# EAGLE schematic brushbot2.0 (EAGLE 9.4.2)
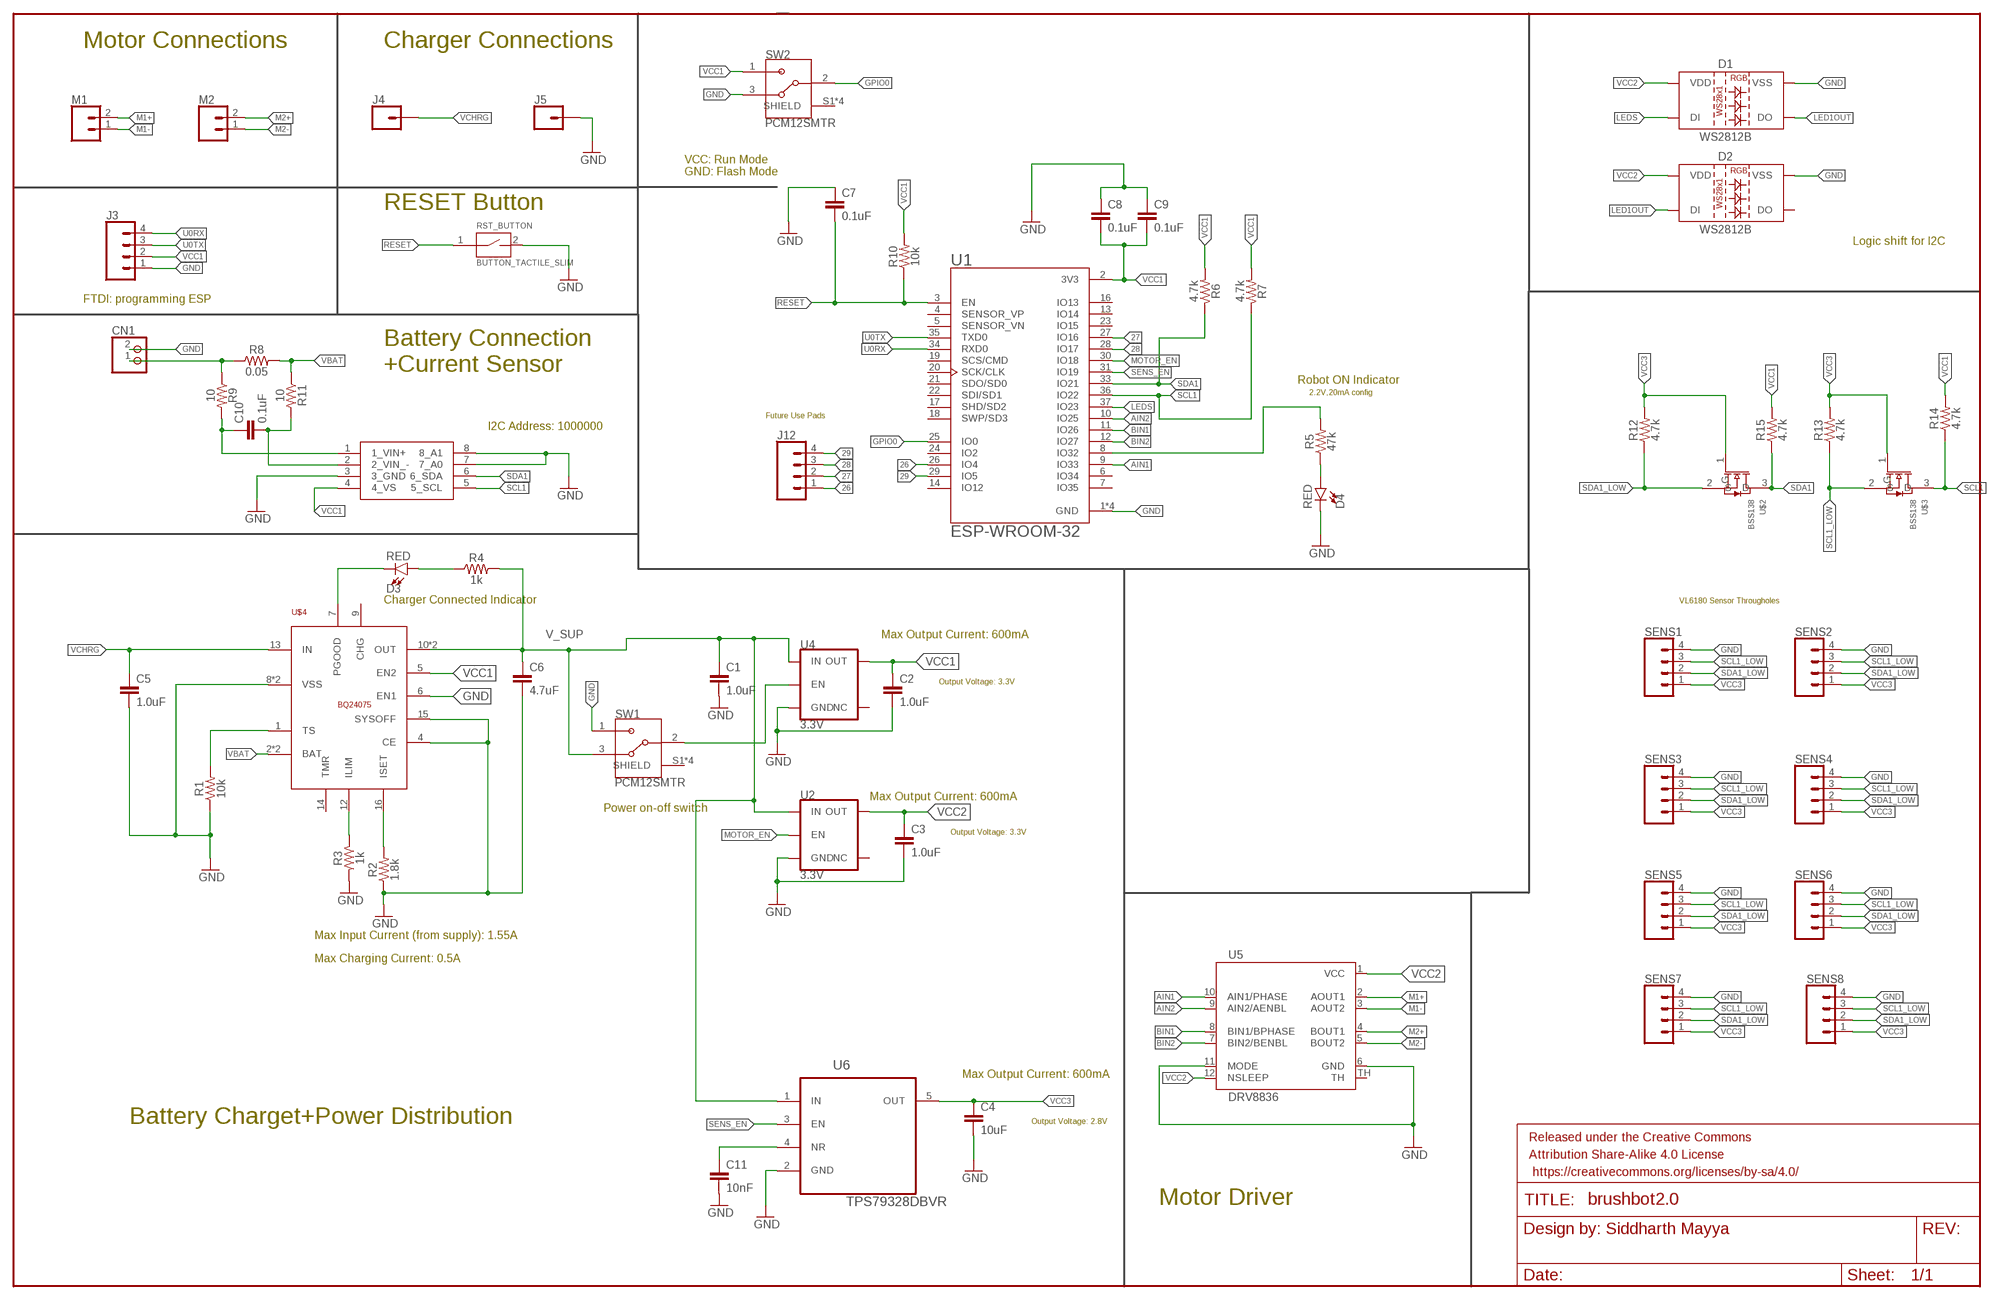
[diagram p0: schematic, sheet 1]

## Parts
C1  1.0uF  1.0UF-0603-16V-10%  [0603]
C2  1.0uF  1.0UF-0603-16V-10%  [0603]
C3  1.0uF  1.0UF-0603-16V-10%  [0603]
C4  10uF  10UF-0603-6.3V-20%  [0603]
C5  1.0uF  1.0UF-0603-16V-10%  [0603]
C6  4.7uF  4.7UF-0603-6.3V-(10%)  [0603]
C7  0.1uF  0.1UF-0603-25V-(+80/-20%)  [0603]
C8  0.1uF  0.1UF-0603-25V-(+80/-20%)  [0603]
C9  0.1uF  0.1UF-0603-25V-(+80/-20%)  [0603]
C10  0.1uF  0.1UF-0603-25V-(+80/-20%)  [0603]
C11  10nF  10NF-0603-50V-10%  [0603]
CN1  JST_2PIN-SMT-RA  [JST-PH-2-SMT-RA]
D1  WS2812B  [WS2812B]
D2  WS2812B  [WS2812B]
D3  RED  LED-RED0603  [LED-0603]
D4  RED  LED-RED0603  [LED-0603]
FRAME2  FRAME-LEDGER  [CREATIVE_COMMONS]
J3  CONN_04PTH  [1X04]
J4  CONN_01  [1X01]
J5  CONN_01  [1X01]
J12  CONN_04PTH  [1X04]
M1  CONN_02  [1X02]
M2  CONN_02  [1X02]
R1  10k  10KOHM-0603-1/10W-1%  [0603]
R2  1.8k  1.8KOHM-0603-1/10W-1%  [0603]
R3  1k  1KOHM-0603-1/10W-1%  [0603]
R4  1k  1KOHM-0603-1/10W-1%  [0603]
R5  47k  47KOHM-0603-1/10W-1%  [0603]
R6  4.7k  4.7KOHM-0603-1/10W-1%  [0603]
R7  4.7k  4.7KOHM-0603-1/10W-1%  [0603]
R8  0.05  0.05OHM-0603-1/5W-1%  [0603]
R9  10  10OHM-0603-1/10W-1%  [0603]
R10  10k  10KOHM-0603-1/10W-1%  [0603]
R11  10  10OHM-0603-1/10W-1%  [0603]
R12  4.7k  4.7KOHM-0603-1/10W-1%  [0603]
R13  4.7k  4.7KOHM-0603-1/10W-1%  [0603]
R14  4.7k  4.7KOHM-0603-1/10W-1%  [0603]
R15  4.7k  4.7KOHM-0603-1/10W-1%  [0603]
RST_BUTTON  BUTTON_TACTILE_SLIM  [BUTTON_TACTILE_SLIM]
SENS1  CONN_04PTH  [1X04]
SENS2  CONN_04PTH  [1X04]
SENS3  CONN_04PTH  [1X04]
SENS4  CONN_04PTH  [1X04]
SENS5  CONN_04PTH  [1X04]
SENS6  CONN_04PTH  [1X04]
SENS7  CONN_04PTH  [1X04]
SENS8  CONN_04PTH  [1X04]
SW1  PCM12SMTR  [SW_PCM12SMTR]
SW2  PCM12SMTR  [SW_PCM12SMTR]
U1  ESP-WROOM-32  [MODULE_ESP-WROOM-32]
U2  3.3V  V_REG_AP2112K-3.3V  [SOT23-5]
U4  3.3V  V_REG_AP2112K-3.3V  [SOT23-5]
U5  DRV8836  [12WSON]
U6  TPS79328DBVR  [SOT95P280X145-5N]
U$1  INA219  [SOT-23-8]
U$2  BSS138  [SOT23-3]
U$3  BSS138  [SOT23-3]
U$4  BQ24075  [QFN16]

## Nets
26: J12.1 U1.26(IO4)
27: J12.2 U1.27(IO16)
28: J12.3 U1.28(IO17)
29: J12.4 U1.29(IO5)
AIN1: U1.9(IO33) U5.10(AIN1/PHASE)
AIN2: U1.10(IO25) U5.9(AIN2/AENBL)
BIN1: U1.11(IO26) U5.8(BIN1/BPHASE)
BIN2: U1.12(IO27) U5.7(BIN2/BENBL)
GND: C1.2 C2.2 C3.2 C4.2 C5.2 C6.2 C7.1 C8.1 C9.1 C11.2 CN1.2 D1.3(VSS) D2.3(VSS) D4.C J3.1 J5.1 R1.1 R2.1 R3.2 RST_BUTTON.2 SENS1.4 SENS2.4 SENS3.4 SENS4.4 SENS5.4 SENS6.4 SENS7.4 SENS8.4 SW1.1 SW2.3 U1.1(GND) U1.1.1(GND) U1.15(GND) U1.38(GND) U2.2(GND) U4.2(GND) U5.6(GND) U5.11(MODE) U6.2(GND) U$1.3(3_GND) U$1.7(7_A0) U$1.8(8_A1) U$4.4(CE) U$4.6(EN1) U$4.8(VSS) U$4.15(SYSOFF) U$4.TH(VSS)
GPIO0: SW2.2 U1.25(IO0)
LED1OUT: D1.2(DO) D2.4(DI)
LEDS: D1.4(DI) U1.37(IO23)
M1+: M1.2 U5.2(AOUT1)
M1-: M1.1 U5.3(AOUT2)
M2+: M2.2 U5.4(BOUT1)
M2-: M2.1 U5.5(BOUT2)
MOTOR_EN: U1.30(IO18) U2.3(EN)
N$1: R1.2 U$4.1(TS)
N$2: SW1.2 U4.3(EN)
N$3: R2.2 U$4.16(ISET)
N$4: R3.1 U$4.12(ILIM)
N$5: C10.1 R9.2 U$1.1(1_VIN+)
N$7: D3.C U$4.7(PGOOD)
N$8: D3.A R4.1
N$9: R5.2 U1.8(IO32)
N$10: D4.A R5.1
N$11: C10.2 R11.2 U$1.2(2_VIN_-)
N$12: CN1.1 R8.1 R9.1
N$14: C11.1 U6.4(NR)
RESET: C7.2 R10.1 RST_BUTTON.1 U1.3(EN)
SCL1: R7.1 R14.1 U1.36(IO22) U$1.5(5_SCL) U$3.3(D)
SCL1_LOW: R13.1 SENS1.3 SENS2.3 SENS3.3 SENS4.3 SENS5.3 SENS6.3 SENS7.3 SENS8.3 U$3.2(S)
SDA1: R6.1 R15.1 U1.33(IO21) U$1.6(6_SDA) U$2.3(D)
SDA1_LOW: R12.1 SENS1.2 SENS2.2 SENS3.2 SENS4.2 SENS5.2 SENS6.2 SENS7.2 SENS8.2 U$2.2(S)
SENS_EN: U1.31(IO19) U6.3(EN)
U0RX: J3.4 U1.34(RXD0)
U0TX: J3.3 U1.35(TXD0)
V_SUP: C1.1 C6.1 R4.2 SW1.3 U2.1(IN) U4.1(IN) U6.1(IN) U$4.10(OUT) U$4.11(OUT)
VBAT: R8.2 R11.1 U$4.2(BAT) U$4.3(BAT)
VCC1: C2.1 C8.2 C9.2 J3.2 R6.2 R7.2 R10.2 R14.2 R15.2 SW2.1 U1.2(3V3) U4.5(OUT) U$1.4(4_VS) U$4.5(EN2)
VCC2: C3.1 D1.1(VDD) D2.1(VDD) U2.5(OUT) U5.1(VCC) U5.12(NSLEEP)
VCC3: C4.1 R12.2 R13.2 SENS1.1 SENS2.1 SENS3.1 SENS4.1 SENS5.1 SENS6.1 SENS7.1 SENS8.1 U6.5(OUT) U$2.1(G) U$3.1(G)
VCHRG: C5.1 J4.1 U$4.13(IN)
Unconnected: D2.2(DO) SW1.S1(SHIELD) SW1.S2(SHIELD) SW1.S3(SHIELD) SW1.S4(SHIELD) SW2.S1(SHIELD) SW2.S2(SHIELD) SW2.S3(SHIELD) SW2.S4(SHIELD) U1.4(SENSOR_VP) U1.5(SENSOR_VN) U1.6(IO34) U1.7(IO35) U1.13(IO14) U1.14(IO12) U1.16(IO13) U1.17(SHD/SD2) U1.18(SWP/SD3) U1.19(SCS/CMD) U1.20(SCK/CLK) U1.21(SDO/SD0) U1.22(SDI/SD1) U1.23(IO15) U1.24(IO2) U2.4(NC) U4.4(NC) U5.TH U$4.9(CHG) U$4.14(TMR)

## Notes on the sheet
- Motor Connections | Charger Connections
- VCC: Run Mode
  GND: Flash Mode
- RESET Button
- Logic shift for I2C
- FTDI: programming ESP
- Battery Connection
  +Current Sensor
- Robot ON Indicator
- 2.2V,20mA config
- Future Use Pads
- I2C Address: 1000000
- Charger Connected Indicator | VL6180 Sensor Througholes
- Max Output Current: 600mA
- Output Voltage: 3.3V
- Max Output Current: 600mA
- Power on-off switch
- Output Voltage: 3.3V
- Max Input Current (from supply): 1.55A
- Max Charging Current: 0.5A
- Max Output Current: 600mA
- Battery Charget+Power Distribution | Output Voltage: 2.8V
- Motor Driver

## Library data of the parts
C1-C3 C5 = SparkFun-Capacitors:1.0UF: 1µF ceramic capacitors A capacitor is a passive two-terminal electrical component used to store electrical energy temporarily in an electric field.; PROD_ID: CAP-00868
C4 = SparkFun-Capacitors:10UF: 10.0µF ceramic capacitors A capacitor is a passive two-terminal electrical component used to store electrical energy temporarily in an electric field.; PROD_ID: CAP-11015
C6 = SparkFun-Capacitors:4.7UF: 4.7µF ceramic capacitors A capacitor is a passive two-terminal electrical component used to store electrical energy temporarily in an electric field.; PROD_ID: CAP-08280
C7-C10 = SparkFun-Capacitors:0.1UF: 0.1µF ceramic capacitors A capacitor is a passive two-terminal electrical component used to store electrical energy temporarily in an electric field.; PROD_ID: CAP-00810
C11 = SparkFun-Capacitors:10NF: 0.01uF/10nF/10,000pF ceramic capacitors A capacitor is a passive two-terminal electrical component used to store electrical energy temporarily in an electric field. CAP-09321; PROD_ID: CAP-00867
CN1 = adafruit:JST_2PIN: JST 2-Pin Connectors of various flavors SMT-RA (S2B-PH-SM4) 4UConnector #17311 SMT (B2B-PH-SM4) THM-RA (S2B-PH) THM (B2B-PH)
D1 D2 = SparkFun-LED:WS2812B: WS2812B SMD addressable RGB LED 5x5mm SMD LED with built-in controller IC. Color: Red/Green/Blue mC Rating: RGB: 390, 660, 180 mcd Forward Voltage: RGB: 2.0, 3.0, 3.0 V Packages:WS2812B SparkFun Products: Blynk Board - ESP8266 <https://www.sparkfun.com/products/13794>; PROD_ID: DIO-12503
D3 D4 = SparkFun-LED:LED-RED: Red SMD LED Used in manufacturing of most products at SparkFun Packages: 0603 - SMD 0603 package [Product Link] <http://docs.avagotech.com/docs/AV02-0551EN> 0603 SMART - SMD 0603 SMART package ( more efficient and expensive)[Product Link] <http://www.osram-os.com/Graphics/XPic2/00077099_0.pdf> 1206 - SMD1206 package [Product Link] <https://www.sparkfun.com/datasheets/DevTools/LilyPad/Q150OVS4.pdff> SparkFun Products: Pro Mini 328 -5V <https://www.sparkfun.com/products/821> RedBoard <https://www.sparkfun.com/products/12757> IOIO-OTG <https://www.sparkfun.com/products/13613>; PROD_ID: DIO-00819
FRAME2 = GRITSBot:FRAME-LEDGER: Schematic Frame Standard 11x14 US Ledger frame
J3 J12 SENS1-SENS8 = SparkFun-Connectors:CONN_04: Multi connection point. Often used as Generic Header-pin footprint for 0.1 inch spaced/style header connections On any of the 0.1 inch spaced packages, you can populate with these: Break Away Headers - Straight <https://www.sparkfun.com/products/116> (PRT-00116) Break Away Male Headers - Right Angle <https://www.sparkfun.com/products/553> (PRT-00553) Female Headers <https://www.sparkfun.com/products/115> (PRT-00115) Break Away Headers - Machine Pin <https://www.sparkfun.com/products/117> (PRT-00117) Break Away Female Headers - Swiss Machine Pin <https://www.sparkfun.com/products/743> (PRT-00743) For SCREWTERMINALS and SPRING TERMINALS visit here: Screw Terimnals on SparkFun.com <https://www.sparkfun.com/search/results?term=Screw+Terminals> (5mm/3.5mm/2.54mm spacing) This device is also useful as a general connection point to wire up your design to another part of your project. Our various solder wires solder well into these plated through hole pads. Hook-Up Wire - Assortment (Stranded, 22 AWG) <https://www.sparkfun.com/products/11375> (PRT-11375) Hook-Up Wire - Assortment (Solid Core, 22 AWG) <https://www.sparkfun.com/products/11367> (PRT-11367) View the entire wire category on our website here <https://www.sparkfun.com/categories/141> Special notes: Molex polarized connector foot print use with SKU : PRT-08231 with associated crimp pins and housings. 1MM SMD Version SKU: PRT-10208; PROD_ID: CONN-09696
J4 J5 = SparkFun-Connectors:CONN_01: Single connection point. Often used as Generic Header-pin footprint for 0.1 inch spaced/style header connections On any of the 0.1 inch spaced packages, you can populate with these: Break Away Headers - Straight <https://www.sparkfun.com/products/116> (PRT-00116) Break Away Male Headers - Right Angle <https://www.sparkfun.com/products/553> (PRT-00553) Female Headers <https://www.sparkfun.com/products/115> (PRT-00115) Break Away Headers - Machine Pin <https://www.sparkfun.com/products/117> (PRT-00117) Break Away Female Headers - Swiss Machine Pin <https://www.sparkfun.com/products/743> (PRT-00743) This device is also useful as a general connection point to wire up your design to another part of your project. Our various solder wires solder well into these plated through hole pads. Hook-Up Wire - Assortment (Stranded, 22 AWG) <https://www.sparkfun.com/products/11375> (PRT-11375) Hook-Up Wire - Assortment (Solid Core, 22 AWG) <https://www.sparkfun.com/products/11367> (PRT-11367) View the entire wire category on our website here <https://www.sparkfun.com/categories/141> Special notes: SMTSO-256-ET is a "flush mount" nut for a 4-40 screw. We mostly use this on specialty testbeds; it is a nice way to connect hardware to your PCB at an adjustable hieght. Also note, the SNAP packages are for using a snappable style connector. We sell a baggie of snaps and they are also used on two LilyPad designs: Snap Assortment - 30 pack (male and female) <https://www.sparkfun.com/products/11347> (DEV-11347) LilyPad Arduino SimpleSnap <https://www.sparkfun.com/products/10941> (DEV-10941) LilyPad SimpleSnap Protoboard <https://www.sparkfun.com/products/10940> (DEV-10940)
M1 M2 = SparkFun-Connectors:CONN_02: Multi connection point. Often used as Generic Header-pin footprint for 0.1 inch spaced/style header connections On any of the 0.1 inch spaced packages, you can populate with these: Break Away Headers - Straight <https://www.sparkfun.com/products/116> (PRT-00116) Break Away Male Headers - Right Angle <https://www.sparkfun.com/products/553> (PRT-00553) Female Headers <https://www.sparkfun.com/products/115> (PRT-00115) Break Away Headers - Machine Pin <https://www.sparkfun.com/products/117> (PRT-00117) Break Away Female Headers - Swiss Machine Pin <https://www.sparkfun.com/products/743> (PRT-00743) For SCREWTERMINALS and SPRING TERMINALS visit here: Screw Terimnals on SparkFun.com <https://www.sparkfun.com/search/results?term=Screw+Terminals> (5mm/3.5mm/2.54mm spacing) This device is also useful as a general connection point to wire up your design to another part of your project. Our various solder wires solder well into these plated through hole pads. Hook-Up Wire - Assortment (Stranded, 22 AWG) <https://www.sparkfun.com/products/11375> (PRT-11375) Hook-Up Wire - Assortment (Solid Core, 22 AWG) <https://www.sparkfun.com/products/11367> (PRT-11367) View the entire wire category on our website here <https://www.sparkfun.com/categories/141> Special notes: Molex polarized connector foot print use with: PRT-08233 with associated crimp pins and housings. 2.54_SCREWTERM for use with PRT-10571. 3.5mm Screw Terminal footprints for PRT-08084 5mm Screw Terminal footprints for use with PRT-08432
R1 R10 = SparkFun-Resistors:10KOHM: 10kΩ resistor A resistor is a passive two-terminal electrical component that implements electrical resistance as a circuit element. Resistors act to reduce current flow, and, at the same time, act to lower voltage levels within circuits. - Wikipedia; PROD_ID: RES-00824
R2 = SparkFun-Resistors:1.8KOHM: 1.8kΩ resistor A resistor is a passive two-terminal electrical component that implements electrical resistance as a circuit element. Resistors act to reduce current flow, and, at the same time, act to lower voltage levels within circuits. - Wikipedia; PROD_ID: RES-09119
R3 R4 = SparkFun-Resistors:1KOHM: 1kΩ resistor A resistor is a passive two-terminal electrical component that implements electrical resistance as a circuit element. Resistors act to reduce current flow, and, at the same time, act to lower voltage levels within circuits. - Wikipedia; PROD_ID: RES-07856
R5 = SparkFun-Resistors:47KOHM: 47kΩ resistor A resistor is a passive two-terminal electrical component that implements electrical resistance as a circuit element. Resistors act to reduce current flow, and, at the same time, act to lower voltage levels within circuits. - Wikipedia; PROD_ID: RES-07871
R6 R7 R12-R15 = SparkFun-Resistors:4.7KOHM: 4.7kΩ resistor A resistor is a passive two-terminal electrical component that implements electrical resistance as a circuit element. Resistors act to reduce current flow, and, at the same time, act to lower voltage levels within circuits. - Wikipedia; PROD_ID: RES-07857
R8 = SparkFun-Resistors:0.05OHM: 0.05Ω resistor A resistor is a passive two-terminal electrical component that implements electrical resistance as a circuit element. Resistors act to reduce current flow, and, at the same time, act to lower voltage levels within circuits. - Wikipedia; PROD_ID: RES-12535
R9 R11 = SparkFun-Resistors:10OHM: 10Ω resistor A resistor is a passive two-terminal electrical component that implements electrical resistance as a circuit element. Resistors act to reduce current flow, and, at the same time, act to lower voltage levels within circuits. - Wikipedia; PROD_ID: RES-12581
RST_BUTTON = GRITSBot:BUTTON_TACTILE_SLIM: SWITCH TACTILE SPST-NO 0.05A 12V (Omron Electronics Inc-EMC Div B3U-1000P-B) Datasheet: http://www.components.omron.com/components/web/PDFLIB.nsf/0/2DD3893C7DD33E9E862572900079E9D6/$file/B3U_1110.pdf Purchase at: http://www.digikey.com/product-detail/en/B3U-1000P-B/SW1143DKR-ND/2567956
SW1 SW2 = PCM12SMTR:PCM12SMTR: Switch Slide ON ON SPDT Side Slide 0.3A 6VDC 10000Cycles Gull Wing SMD T/R; AVAILABILITY: Unavailable; DESCRIPTION: Switch Slide ON ON SPDT Side Slide 0.3A 6VDC 10000Cycles Gull Wing SMD T/R; MF: C&K; MP: PCM12SMTR; PACKAGE: DO-201 C&amp;K Components; PRICE: None
U1 = ESP-WROOM-32:ESP-WROOM-32: Module: combo; GPIO, I2C x2, I2S x2, SDIO, SPI x3, UART x3; 19.5dBm; DESCRIPTION: Module: combo; GPIO, I2C x2, I2S x2, SDIO, SPI x3, UART x3; 19.5dBm; DIGI-KEY_PART_NUMBER: 1188-1178-ND; DIGI-KEY_PURCHASE_URL: https://www.digikey.com/product-detail/en/olimex-ltd/ESP-WROOM-32/1188-1178-ND/6580750?utm_source=snapeda&utm_medium=aggregator&utm_campaign=symbol; MF: Olimex LTD; MP: ESP-WROOM-32; PACKAGE: Module Olimex LTD
U2 U4 = SparkFun-IC-Power:V_REG_AP2112: AP2112 - 600mA CMOS LDO Regulator w/ Enable The AP2112 is CMOS process low dropout linear regulator with enable function, the regulator delivers a guaranteed 600mA (min.) continuous load current. Features Output Voltage Accuracy: ±1.5% Output Current: 600mA (Min.) Foldback Short Current Protection: 50mA Enable Function to Turn ON/OFF VOUT Low Dropout Voltage (3.3V): 250mV (Typ.) @IOUT=600mA Excellent Load Regulation: 0.2%/A (Typ.) Excellent Line Regulation: 0.02%/V (Typ.) Low Quiescent Current: 55μA (Typ.) Low Standby Current: 0.01μA (Typ.) Low Output Noise: 50μVRMS PSRR: 100Hz -65dB, 1kHz -65dB OTSD Protection Stable with 1.0μF Flexible Cap: Ceramic, Tantalum and Aluminum Electrolytic Operation Temperature Range: -40°C to 85°C ESD: MM 400V, HBM 4000V; PROD_ID: VREG-12457
U5 = balto:DRV8836: Dual low voltage H-Bridge IC
U6 = TPS79328DBVR:TPS79328DBVR: ULTRALOW-NOISE, HIGH PSRR, FAST RF 200mA LOW-DROPOUT LINEAR REGULATORS IN NanoStar? WAFER CHIP SCALE AND SOT23; AVAILABILITY: Unavailable; DESCRIPTION: Single Output LDO, 200mA, Fixed_2.8V_, High PSRR, Low Noise 5-SOT-23 -40 to 125; MF: Texas Instruments; MP: TPS79328DBVR; PACKAGE: SOT-23-5 Texas Instruments; PRICE: None
U$1 = GRITSBot:INA219: TI Zero-Drift, Bi-Directional CURRENT/POWER MONITOR with I2C Interface The INA219 is a high-side current shunt and power monitor with an I2C interface. The INA219 monitors bothshunt drop and supply voltage. Datasheet: http://www.ti.com/lit/ds/symlink/ina219.pdf
U$2 U$3 = GRITSBot:BSS138: Fairchild Semiconductor BSS138, MOSFET N-CH 50V 220MA SOT-23 Datasheet: http://www.fairchildsemi.com/datasheets/BS/BSS138.pdf Purchase at: http://www.digikey.com/product-detail/en/BSS138/BSS138CT-ND/244294
U$4 = TI-bq24075:BQ24075